# Altium schematic sheet Pg01_Title Page.SchDoc: ARMflash C V
size A3; DrawnBy: RvS; DocumentNumber: 1; SheetNumber: 1; SheetTotal: 16
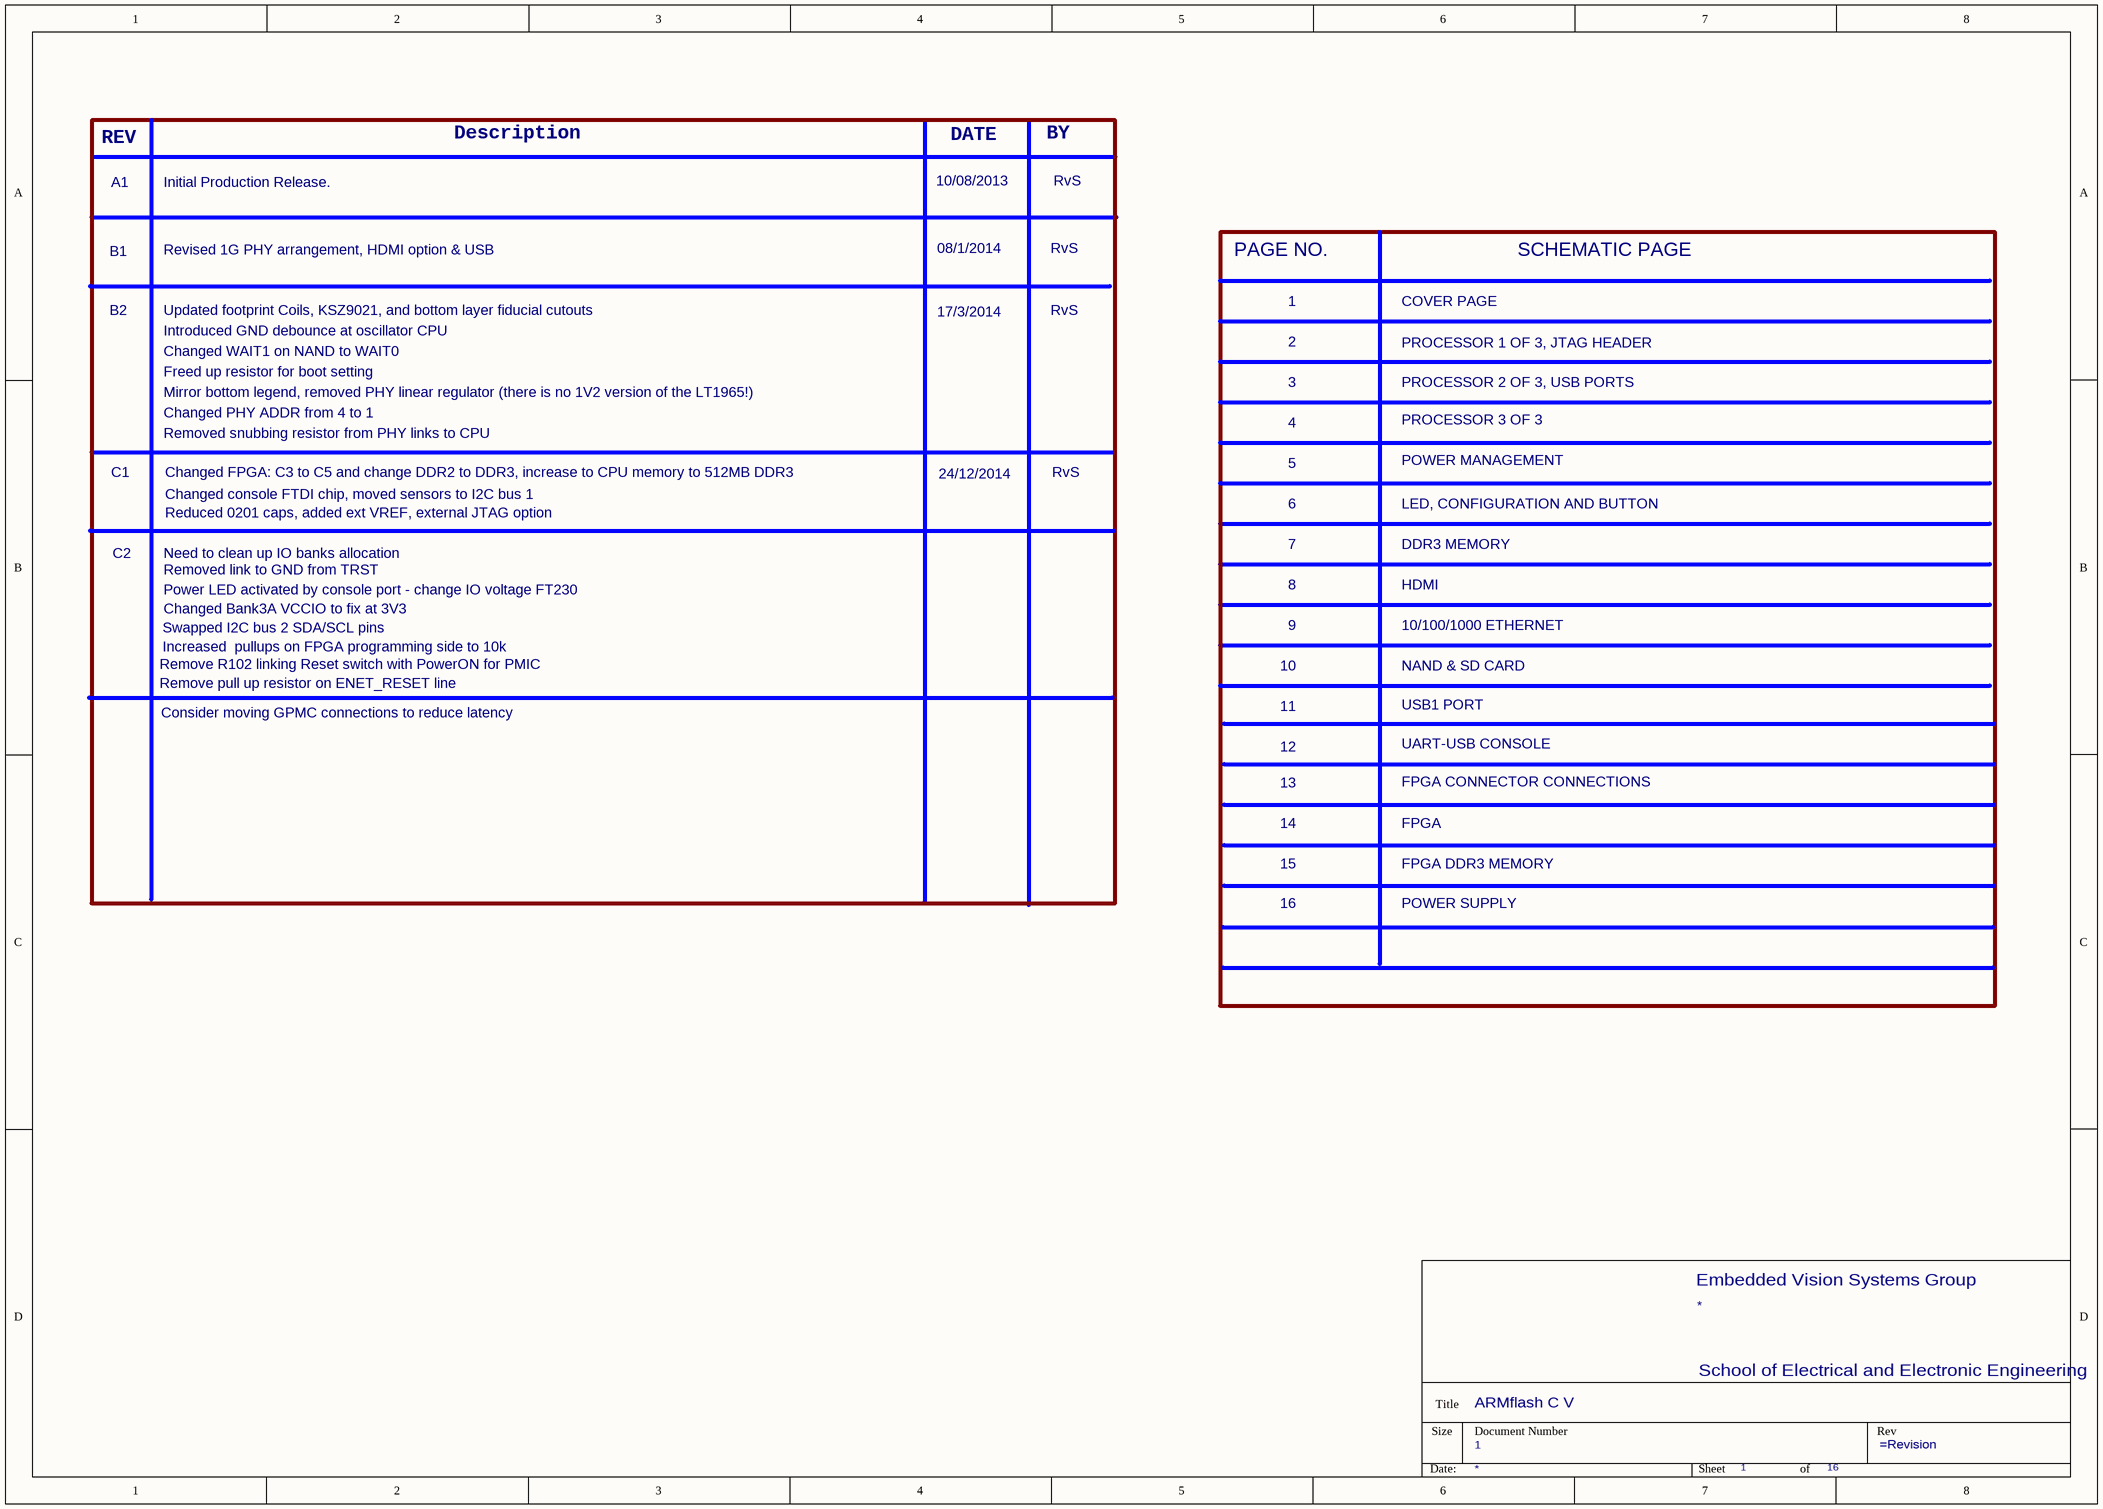
[diagram p0: Pg01_Title Page.SchDoc]

## Parts
?  (no value)  (graphical)

## Notes on the sheet
- REV
- Description
- DATE
- BY
- A1
- Initial Production Release.
- 10/08/2013
- RvS
- B1
- B2
- Revised 1G PHY arrangement, HDMI option & USB
- Updated footprint Coils, KSZ9021, and bottom layer fiducial cutouts
- 08/1/2014
- 17/3/2014
- PAGE NO.
- 1
- COVER PAGE
- SCHEMATIC PAGE
- Freed up resistor for boot setting
- Changed WAIT1 on NAND to WAIT0
- Introduced GND debounce at oscillator CPU
- 2
- PROCESSOR 1 OF 3, JTAG HEADER
- Mirror bottom legend, removed PHY linear regulator (there is no 1V2 version of the LT1965!)
- Changed PHY ADDR from 4 to 1
- Removed snubbing resistor from PHY links to CPU
- 3
- 4
- PROCESSOR 2 OF 3, USB PORTS
- PROCESSOR 3 OF 3
- C1
- Changed FPGA: C3 to C5 and change DDR2 to DDR3, increase to CPU memory to 512MB DDR3
- Changed console FTDI chip, moved sensors to I2C bus 1
- Reduced 0201 caps, added ext VREF, external JTAG option
- 24/12/2014
- 5
- 6
- LED, CONFIGURATION AND BUTTON
- POWER MANAGEMENT
- C2
- Need to clean up IO banks allocation
- Removed link to GND from TRST
- 7
- DDR3 MEMORY
- Swapped I2C bus 2 SDA/SCL pins
- Increased  pullups on FPGA programming side to 10k
- Power LED activated by console port - change IO voltage FT230
- Changed Bank3A VCCIO to fix at 3V3
- 8
- 9
- HDMI
- 10/100/1000 ETHERNET
- Remove R102 linking Reset switch with PowerON for PMIC
- Remove pull up resistor on ENET_RESET line
- Consider moving GPMC connections to reduce latency
- 10
- 11
- NAND & SD CARD
- USB1 PORT
- 12
- 13
- UART-USB CONSOLE
- FPGA CONNECTOR CONNECTIONS
- 14
- FPGA
- 15
- 16
- FPGA DDR3 MEMORY
- POWER SUPPLY
- Embedded Vision Systems Group
- School of Electrical and Electronic Engineering
- Size
- Title
- Document Number
- Rev
- Date:
- Sheet
- of

## Library data of the parts
? = Title Block Address(1): UoM title block